# Altium schematic sheet logic_000.SchDoc: Logic control
size A3; SheetNumber: 4; SheetTotal: 4
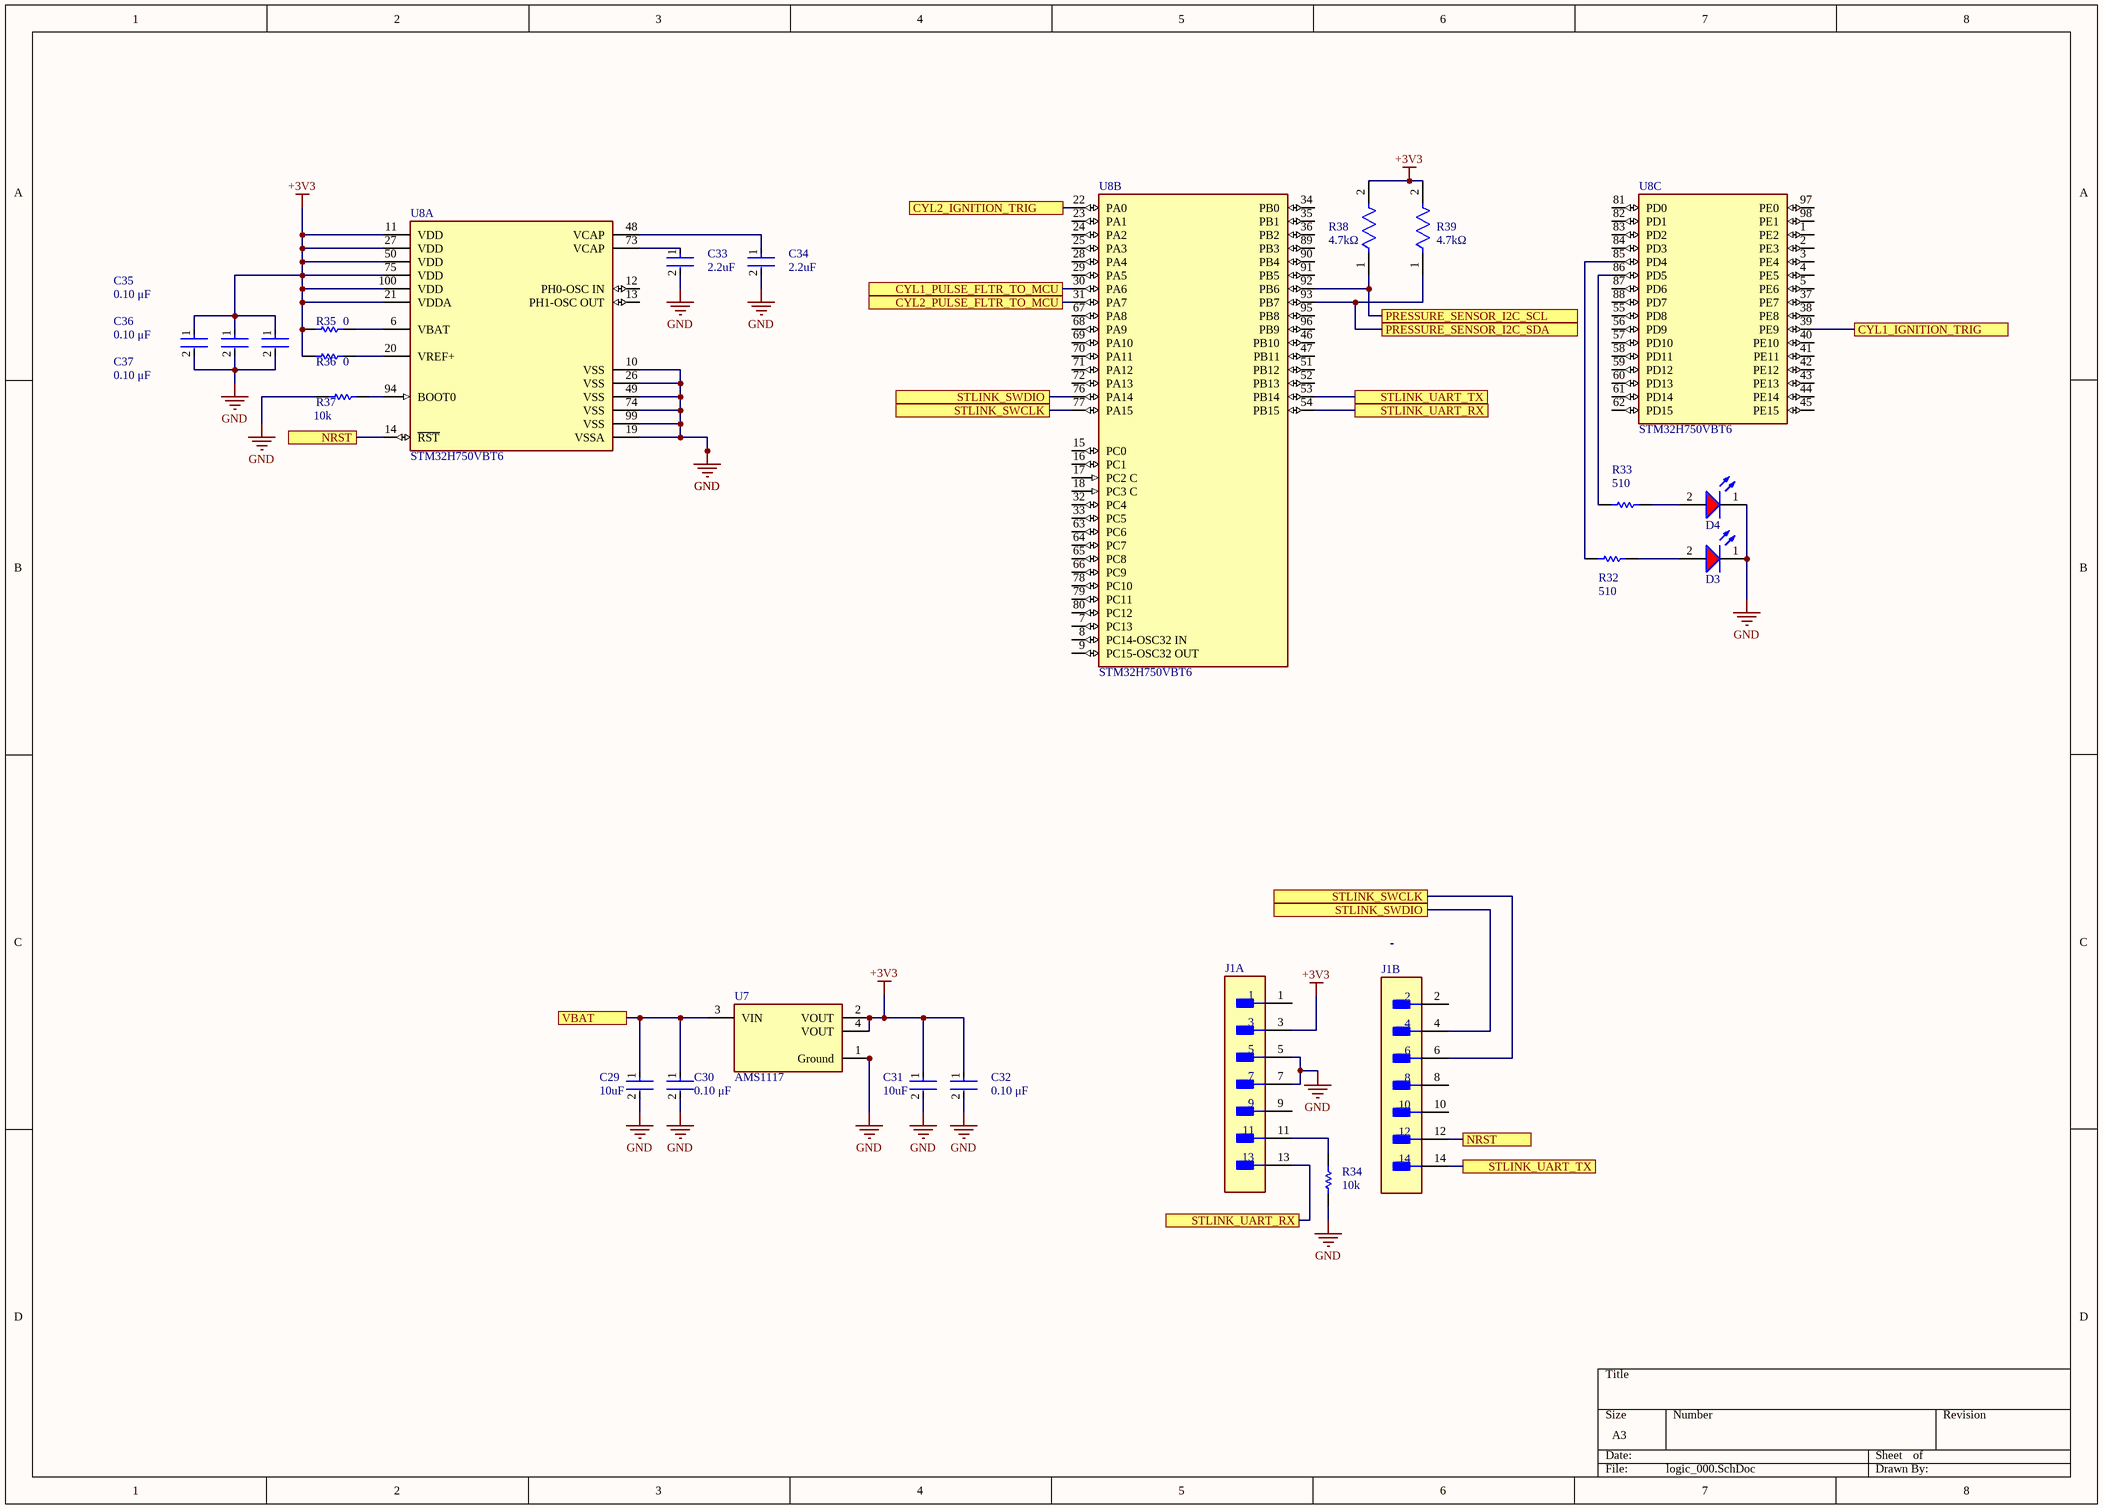
[diagram p0: logic_000.SchDoc]

## Parts
C29  Capacitance: 10uF  [FP-CL05A106MP5NUNC-MFG]  (hidden comment: CL05A106MP5NUNC)
C30  Capacitance: 0.10 μF  [FP-C0402-BB-MFG]  (hidden comment: C0402C104K8PACTU)
C31  Capacitance: 10uF  [FP-CL05A106MP5NUNC-MFG]  (hidden comment: CL05A106MP5NUNC)
C32  Capacitance: 0.10 μF  [FP-C0402-BB-MFG]  (hidden comment: C0402C104K8PACTU)
C33  Capacitance: 2.2uF  [FP-GRM155-0_05-MFG]  (hidden comment: GRM155R61A225KE95D)
C34  Capacitance: 2.2uF  [FP-GRM155-0_05-MFG]  (hidden comment: GRM155R61A225KE95D)
C35  value 0.10 μF  [FP-C0402-BB-MFG]  (hidden comment: C0402C104K8PACTU)
C36  value 0.10 μF  [FP-C0402-BB-MFG]  (hidden comment: C0402C104K8PACTU)
C37  value 0.10 μF  [FP-C0402-BB-MFG]  (hidden comment: C0402C104K8PACTU)
D3  150080SS75000  [WL-SMCW_0805_150080xx75000]  (value not drawn)
D4  150080SS75000  [WL-SMCW_0805_150080xx75000]  (value not drawn)
J1  FTSH-107-01-L-DV-K  [FP-FTSH-107-01-L-DV-K-MFG]  (value not drawn)  (parts A,B of 2)
R32  value 510  [RESC1005X40X25LL05T10]  (hidden comment: RC0402FR-07510RL)
R33  value 510  [RESC1005X40X25LL05T10]  (hidden comment: RC0402FR-07510RL)
R34  value 10k  [RESC1005X40X25LL05T10]  (hidden comment: RC0402FR-0710KL)
R35  value 0  [RESC1005X40X25NL05T10]  (hidden comment: RC0402JR-070RL)
R36  value 0  [RESC1005X40X25NL05T10]  (hidden comment: RC0402JR-070RL)
R37  value 10k  [RESC1005X40X25LL05T10]  (hidden comment: RC0402FR-0710KL)
R38  Resistance: 4.7kΩ  [FP-RC0402-0_4-MFG]  (hidden comment: RC0402JR-074K7L)
R39  Resistance: 4.7kΩ  [FP-RC0402-0_4-MFG]  (hidden comment: RC0402JR-074K7L)
U7  Package: AMS1117  [FP-AMS1117-IPC_C]  (hidden comment: AMS1117-3.3)
U8  STM32H750VBT6  [FP-LQFP100-1L-MFG]  (parts A,B,C of 3)

## Ports
CYL1_IGNITION_TRIG (see power_side[4B]), CYL1_PULSE_FLTR_TO_MCU (see input_filter[6A]), CYL2_IGNITION_TRIG (see power_side[4B]), CYL2_PULSE_FLTR_TO_MCU (see input_filter[6B]), NRST (see logic_000[2B]), NRST (see logic_000[6D]), PRESSURE_SENSOR_I2C_SCL (see input_output[6B]), PRESSURE_SENSOR_I2C_SDA (see input_output[6B]), STLINK_SWCLK (see logic_000[4B]), STLINK_SWCLK (see logic_000[5C]), STLINK_SWDIO (see logic_000[4B]), STLINK_SWDIO (see logic_000[5C]), STLINK_UART_RX (see logic_000[5D]), STLINK_UART_RX (see logic_000[6B]), STLINK_UART_TX (see logic_000[6B]), STLINK_UART_TX (see logic_000[6D]), VBAT (see input_output[7A], power_side[2A], power_side[2C], power_side[5B])

## Nets
+3V3: C31.1 C32.1 C35.1 C36.1 C37.1 J1.3 R35.1 R36.1 R38.2 R39.2 U7.2(VOUT) U7.4(VOUT) U8.11(VDD) U8.21(VDDA) U8.27(VDD) U8.50(VDD) U8.75(VDD) U8.100(VDD)
GND: C29.2 C30.2 C31.2 C32.2 C33.2 C34.2 C35.2 C36.2 C37.2 D3.1(K) D4.1(K) J1.5 J1.7 R34.1 R37.1 U7.1(Ground) U8.10(VSS) U8.19(VSSA) U8.26(VSS) U8.49(VSS) U8.74(VSS) U8.99(VSS)
CYL1_IGNITION_TRIG: U8.39(PE9) ; port CYL1_IGNITION_TRIG
CYL1_PULSE_FLTR_TO_MCU: U8.30(PA6) ; port CYL1_PULSE_FLTR_TO_MCU
CYL2_IGNITION_TRIG: U8.22(PA0) ; port CYL2_IGNITION_TRIG
CYL2_PULSE_FLTR_TO_MCU: U8.31(PA7) ; port CYL2_PULSE_FLTR_TO_MCU
NRST: J1.12 U8.14(~{RST}) ; port NRST
PRESSURE_SENSOR_I2C_SCL: R38.1 U8.92(PB6) ; port PRESSURE_SENSOR_I2C_SCL
PRESSURE_SENSOR_I2C_SDA: R39.1 U8.93(PB7) ; port PRESSURE_SENSOR_I2C_SDA
STLINK_SWCLK: J1.6 U8.77(PA15) ; port STLINK_SWCLK
STLINK_SWDIO: J1.4 U8.76(PA14) ; port STLINK_SWDIO
STLINK_UART_RX: J1.13 U8.54(PB15) ; port STLINK_UART_RX
STLINK_UART_TX: J1.14 U8.53(PB14) ; port STLINK_UART_TX
VBAT: C29.1 C30.1 U7.3(VIN) ; port VBAT
NetC33_1: C33.1 U8.73(VCAP)
NetC34_1: C34.1 U8.48(VCAP)
NetD3_2: D3.2(A) R32.1
NetD4_2: D4.2(A) R33.1
NetJ1_11: J1.11 R34.2
NetR32_2: R32.2 U8.85(PD4)
NetR33_2: R33.2 U8.86(PD5)
NetR35_2: R35.2 U8.6(VBAT)
NetR36_2: R36.2 U8.20(VREF+)
NetR37_2: R37.2 U8.94(BOOT0)

Not connected (* = marked no-connect by the designer): J1 1 2 8 9 10; U8 1(PE2) 2(PE3) 3(PE4) 4(PE5) 5(PE6) 7(PC13) 8(PC14-OSC32_IN) 9(PC15-OSC32_OUT) 12(PH0-OSC_IN) 13(PH1-OSC_OUT) 15(PC0) 16(PC1) 17(PC2_C) 18(PC3_C) 23(PA1) 24(PA2) 25(PA3) 28(PA4) 29(PA5) 32(PC4) 33(PC5) 34(PB0) 35(PB1) 36(PB2) 37(PE7) 38(PE8) 40(PE10) 41(PE11) 42(PE12) 43(PE13) 44(PE14) 45(PE15) 46(PB10) 47(PB11) 51(PB12) 52(PB13) 55(PD8) 56(PD9) 57(PD10) 58(PD11) 59(PD12) 60(PD13) 61(PD14) 62(PD15) 63(PC6) 64(PC7) 65(PC8) 66(PC9) 67(PA8) 68(PA9) 69(PA10) 70(PA11) 71(PA12) 72(PA13) 78(PC10) 79(PC11) 80(PC12) 81(PD0) 82(PD1) 83(PD2) 84(PD3) 87(PD6) 88(PD7) 89(PB3) 90(PB4) 91(PB5) 95(PB8) 96(PB9) 97(PE0) 98(PE1)

## Library data of the parts
C29 C31 = CMP-13271-000002-1: CAP CER 10UF 10V X5R 0402; Manufacturer: Samsung; Temperature Coefficient: 15%; Tolerance: 20%; Material: Ceramic; Octopart: https://octopart.com/cl05a106mp5nunc-samsung-22457395; Voltage Rating: 10V; RoHS: TRUE; Value: 10uF; Height: 0.7mm; Digikey Description: CAP CER 10UF 10V X5R 0402; Automotive: No; Package: CL05A106MP5NUNC; Device Class L1: Passive Components; Temperature Range High: +85°C; ComponentLink2Description: Datasheet; Device Class L2: Capacitors; Temperature Characteristic: X5R; Manufacturer Part Number: CL05A106MP5NUNC; Temperature: -55°C to +85°C; ComponentLink2URL: http://www.samsungsem.com/kr/support/product-search/mlcc/__icsFiles/afieldfile/2019/05/10/19-CL05A106MP5NUNC.pdf; Device Class L3: Ceramic Capacitors; Category: Cap; Temperature Range Low: -55°C; Ipc Land Pattern Name: CAPC10050X50; Lead Free: Yes
C30 C32 = CMP-2008-02046-2: CAP CER 0.1UF 10V X5R 0402; Manufacturer: Kemet; Material: Ceramic; Temperature Coefficient: 15%; Tolerance: 0.1; Value: 0.10 μF; Package: C0402-BB; Temperature: -55°C to +125°C; ComponentLink2Description: Datasheet; Temperature Characteristic: X5R; Device Class L1: Passive Components; Height: 0.55mm; Lead Free: Yes; ComponentLink2URL: https://content.kemet.com/datasheets/KEM_C1002_X7R_SMD.pdf; Device Class L2: Capacitors; Temperature Range Low: -55°C; Temperature Range High: +125°C; RoHS: TRUE; Octopart: https://octopart.com/c0402c104k8pactu-kemet-140039; Automotive: No; Mouser Description: Capacitor 100 nF 10 VDC 0402; Category: Cap; Voltage Rating: 10 V; Digikey Description: CAP CER 0.1UF 10V X5R 0402; Ipc Land Pattern Name: CAPC10050X50; Device Class L3: Ceramic Capacitors; Manufacturer Part Number: C0402C104K8PACTU
C33 C34 = CMP-06035-063009-1: CAP CER 2.2UF 10V X5R 0402; Material: Ceramic; Tolerance: 10%; Max Operating Temperature: 85°C; Min Operating Temperature: -55°C; Weight: 0.000212oz; Lead Free: Lead Free; Case Code (Imperial): 0402; Case Code (Metric): 1005; Length: 1mm; Packaging: Tape and Reel; Depth: 0.5mm; Voltage Rating: 10V; REACH SVHC: No SVHC; Width: 0.5mm; Case/Package: 0402; RoHS Compliant: Yes; Termination: SMD/SMT; Voltage Rating (DC): 10V; Height: 0.5mm; Mount: Surface Mount; Package Quantity: 10000; Dielectric: X5R; Thickness: 0.022inch
C35-C37 = CMP-2008-02046-2: CAP CER 0.1UF 10V X5R 0402; Manufacturer: Kemet; Material: Ceramic; Temperature Coefficient: 15%; Tolerance: 0.1; Package: C0402-BB; Temperature: -55°C to +125°C; ComponentLink2Description: Datasheet; Capacitance: 0.10 μF; Temperature Characteristic: X5R; Device Class L1: Passive Components; Height: 0.55mm; Lead Free: Yes; ComponentLink2URL: https://content.kemet.com/datasheets/KEM_C1002_X7R_SMD.pdf; Device Class L2: Capacitors; Temperature Range Low: -55°C; Temperature Range High: +125°C; RoHS: TRUE; Octopart: https://octopart.com/c0402c104k8pactu-kemet-140039; Automotive: No; Mouser Description: Capacitor 100 nF 10 VDC 0402; Category: Cap; Voltage Rating: 10 V; Digikey Description: CAP CER 0.1UF 10V X5R 0402; Ipc Land Pattern Name: CAPC10050X50; Device Class L3: Ceramic Capacitors; Manufacturer Part Number: C0402C104K8PACTU
D3 D4 = CMP-1426-00010-4: Led, Red, 630 Nm, 1.9 V, 30 Ma, 60 Mcd Rohs Compliant: Yes; Reverse Voltage: 5V; Test Current: 20mA; Forward Current: 100mA; Power Dissipation: 72mW; Peak Wavelength: 645nm; Lens Style: Clear, Rectangular; Viewing Angle: 140°; Forward Voltage: 1.9V; Luminous Intensity: 60mcd; Wavelength: 630nm; Max Junction Temperature (Tj): 95°C; Color: Red; Case/Package: 0805; Length: 2mm; RoHS: Compliant; Max Operating Temperature: 85°C; Min Operating Temperature: -40°C; Case Code (Metric): 2012; Case Code (Imperial): 0805; Dominant Wavelength: 630nm; Max Reverse Voltage (DC): 5V; REACH SVHC: Unknown; Packaging: Tape and Reel; Mount: Surface Mount; Width: 1.25mm; Height: 700µm
J1 = CMP-02766-001412-1: CONN HEADER SMD 14POS 1.27MM; Number of Contacts: 14; Gender: Male; Termination: Solder; Lead Free: Lead Free; Depth: 5.84mm; Min Operating Temperature: -55°C; Length: 8.89mm; RoHS Compliant: Yes; Housing Material: Polymer; Housing Color: Black; Max Operating Temperature: 125°C; Number of Rows: 2; Pitch: 1.27mm; Radiation Hardening: No; Orientation: Straight; Packaging: Rail/Tube; Contact Material: Bronze; Contact Plating: Gold
R32 R33 = CMP-2002-07727-1: Manufacturer: Yageo / Phycomp; Part Number: RC0402FR-07510RL
R34 R37 = CMP-2002-07353-1: Manufacturer: Yageo / Phycomp; Part Number: RC0402FR-0710KL
R35 R36 = CMP-1011-00001-2: Manufacturer: Yageo / Phycomp; Part Number: RC0402JR-070RL
R38 R39 = CMP-2002-08011-2: Tolerance: 5%; Power Rating: 63mW; Voltage Rating: 50V; Temperature Coefficient: 100ppm/°C; Composition: Thick Film; Max Operating Temperature: 155°C; Case/Package: 0402; Depth: 500µm; Packaging: Tape & Reel; Number of Pins: 2; Schedule B: 8533210045, 8533210045; Case Code (Imperial): 0402; Termination: SMD/SMT; Military Standard: Not; Lead Free: Lead Free; Width: 500µm; REACH SVHC: No SVHC; Max Power Dissipation: 63mW; Voltage Rating (AC): 50V; Features: Moisture Resistant; Min Operating Temperature: -55°C; Number of Terminations: 2; RoHS: Compliant; Height: 350µm; Voltage Rating (DC): 50V; Length: 1mm
U7 = CMP-209535-000001-1: LDO Voltage Regulators 1A, 3.3V; Manufacturer: Advanced Monolithic Systems; Dropout Voltage: 1.1V; Output Type: Fixed; Nominal Supply Current: 5mA; Max Power Dissipation: 1.2W; Max Supply Voltage: 15V; Number Of Outputs: 1; Standoff Height: 0.64mm; Max Junction Temp: +125°C; Height: 1.8mm; Device Class L2: Power Management ICs; ComponentLink2Description: Datasheet; ComponentLink2URL: http://www.advanced-monolithic.com/pdf/ds1117.pdf; Category: IC; RoHS: TRUE; Automotive: No; Device Class L1: Integrated Circuits (ICs); Output Current: 1A; Device Class L3: Voltage Regulators - Linear; Temperature: -40°C to +125°C; Output Voltage: 3.3V; Manufacturer Part Number: AMS1117-3.3; Temperature Range Low: -40°C; Octopart: https://octopart.com/ams1117-3.3-advanced+monolithic+systems-25899300; Lead Free: Yes; Ipc Land Pattern Name: SOT229P700X180-4; Temperature Range High: +125°C
U8 = CMP-12105-000017-1: IC MCU 32BIT 128KB FLASH 100LQFP; Manufacturer: STMicroelectronics; Number Of Uart Channels: 9; Number Of I/Os: 82; Max Junction Temp: +125°C; Data Bus Width: 32bits; Ram Size: 1MBytes; Min Supply Voltage: 1.62V; Number Of Spi Channels: 6; Number Of Adc Channels: 36; Max Supply Voltage: 3.6V; Standoff Height: 0.05mm; Interface: I2C,SPI,UART,USART,CAN,USB,LIN,IrDA,Ethernet,I2S,Other; Number Of A/D Converters: 3; Number Of I2C Channels: 4; Memory Size: 128KBytes; Frequency: 480MHz; Number Of Timers/Counters: 20; Number Of Ethernet Channels: 1; Core Architecture: ARM Cortex-M7; Number Of Usb Channels: 2; Number Of Pwm Channels: 42; Ambient Temperature Range High: +85°C; Temperature: -40°C to +125°C; ComponentLink2URL: https://www.st.com/resource/en/datasheet/stm32h750vb.pdf; Device Class L2: Embedded Processors and Controllers; Temperature Range Low: -40°C; Octopart: https://octopart.com/stm32h750vbt6-stmicroelectronics-94048547; Category: IC; Manufacturer Part Number: STM32H750VBT6; Height: 1.6mm; Lead Free: Yes; Device Class L1: Integrated Circuits (ICs); Digikey Description: IC MCU 32BIT 128KB FLASH 100LQFP; RoHS: TRUE; Ambient Temperature Range Low: -40°C; Device Class L3: Microcontrollers; ComponentLink2Description: Datasheet; Mouser Description: MCU 32-Bit STM32H750VB ARM Cortex M7 RISC 128KB Flash 1.8V/2.5V/3.3V 100-Pin LQFP Tray; Number Of Cores: 1; Automotive: No; Memory Type: FLASH; Package: LQFP100-1L; Temperature Range High: +125°C